# Altium project AudioAmp.PrjPcb
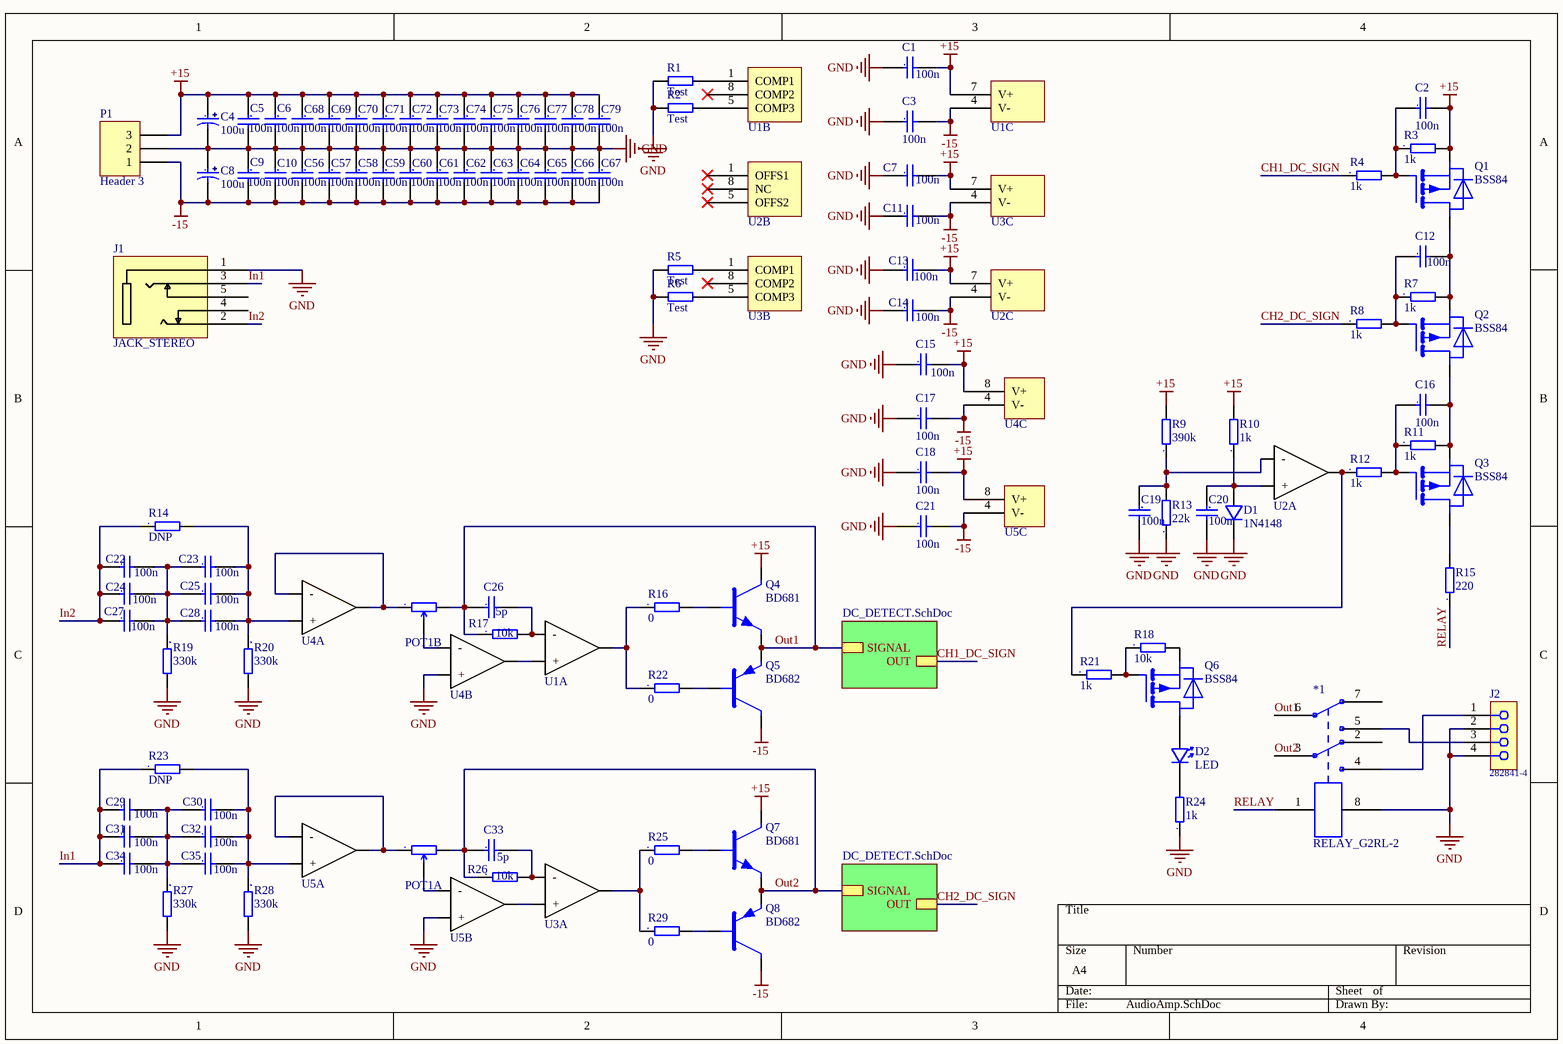
[diagram p0: AudioAmp.SchDoc]
2 sheets, 152 parts. Net scope: hierarchical (ports join the sheet entries above them; power ports are global).
Board file: AudioAmp.PcbDoc
Sheets:
  AudioAmp.SchDoc
    U_DC_DETECT = DC_DETECT.SchDoc
    U_DC_DETECT = DC_DETECT.SchDoc

## Sheet AudioAmp.SchDoc
size A4

### Parts
*1  RELAY_G2RL-2  [G2RL-2]
C1  100n  [C0603_N]
C2  100n  [C0603_N]
C3  100n  [C0603_N]
C4  100u  [C_TR3D]
C5  100n  [C0603_N]
C6  100n  [C0603_N]
C7  100n  [C0603_N]
C8  100u  [C_TR3D]
C9  100n  [C0603_N]
C10  100n  [C0603_N]
C11  100n  [C0603_N]
C12  100n  [C0603_N]
C13  100n  [C0603_N]
C14  100n  [C0603_N]
C15  100n  [C0603_N]
C16  100n  [C0603_N]
C17  100n  [C0603_N]
C18  100n  [C0603_N]
C19  100n  [C0603_N]
C20  100n  [C0603_N]
C21  100n  [C0603_N]
C22  100n  [C0603_N]
C23  100n  [C0603_N]
C24  100n  [C0603_N]
C25  100n  [C0603_N]
C26  5p  [C0603_N]
C27  100n  [C0603_N]
C28  100n  [C0603_N]
C29  100n  [C0603_N]
C30  100n  [C0603_N]
C31  100n  [C0603_N]
C32  100n  [C0603_N]
C33  5p  [C0603_N]
C34  100n  [C0603_N]
C35  100n  [C0603_N]
C56  100n  [C0603_N]
C57  100n  [C0603_N]
C58  100n  [C0603_N]
C59  100n  [C0603_N]
C60  100n  [C0603_N]
C61  100n  [C0603_N]
C62  100n  [C0603_N]
C63  100n  [C0603_N]
C64  100n  [C0603_N]
C65  100n  [C0603_N]
C66  100n  [C0603_N]
C67  100n  [C0603_N]
C68  100n  [C0603_N]
C69  100n  [C0603_N]
C70  100n  [C0603_N]
C71  100n  [C0603_N]
C72  100n  [C0603_N]
C73  100n  [C0603_N]
C74  100n  [C0603_N]
C75  100n  [C0603_N]
C76  100n  [C0603_N]
C77  100n  [C0603_N]
C78  100n  [C0603_N]
C79  100n  [C0603_N]
D1  1N4148  [SOD-80]
D2  LED  [LED_3mm]
J1  JACK_STEREO  [1503 09]
J2  282841-4  [TERM_BLOCK_4x1]
P1  Header 3  [HDR1X3]
POT1  RES_POT_S  [POT_STEREO]  (value not drawn)  (parts A,B of 2)
Q1  BSS84  [SOT23_123_N]
Q2  BSS84  [SOT23_123_N]
Q3  BSS84  [SOT23_123_N]
Q4  BD681  [TO-126]
Q5  BD682  [TO-126]
Q6  BSS84  [SOT23_123_N]
Q7  BD681  [TO-126]
Q8  BD682  [TO-126]
R1  Test  [R0603_N]
R2  Test  [R0603_N]
R3  1k  [R0603_N]
R4  1k  [R0603_N]
R5  Test  [R0603_N]
R6  Test  [R0603_N]
R7  1k  [R0603_N]
R8  1k  [R0603_N]
R9  390k  [R0603_N]
R10  1k  [R0603_N]
R11  1k  [R0603_N]
R12  1k  [R0603_N]
R13  22k  [R0603_N]
R14  DNP  [R0603_N]
R15  220  [R0603_N]
R16  0  [R0603_N]
R17  10k  [R0603_N]
R18  10k  [R0603_N]
R19  330k  [R0603_N]
R20  330k  [R0603_N]
R21  1k  [R0603_N]
R22  0  [R0603_N]
R23  DNP  [R0603_N]
R24  1k  [R0603_N]
R25  0  [R0603_N]
R26  10k  [R0603_N]
R27  330k  [R0603_N]
R28  330k  [R0603_N]
R29  0  [R0603_N]
U1  LM318  [SOIC-8]  (value not drawn)  (parts A,B,C of 3)
U2  uA741  [SOIC-8]  (value not drawn)  (parts A,B,C of 3)
U3  LM318  [SOIC-8]  (value not drawn)  (parts A,B,C of 3)
U4  TL072  [SOIC-8]  (value not drawn)  (parts A,B,C of 3)
U5  TL072  [SOIC-8]  (value not drawn)  (parts A,B,C of 3)

### Sub-sheets
U_DC_DETECT = DC_DETECT.SchDoc: SIGNAL, OUT
U_DC_DETECT = DC_DETECT.SchDoc: SIGNAL, OUT

### Nets
+15: C1.2 C2.2 C4.P C5.1 C6.1 C7.2 C13.2 C15.2 C18.2 C68.1 C69.1 C70.1 C71.1 C72.1 C73.1 C74.1 C75.1 C76.1 C77.1 C78.1 C79.1 P1.3 Q1.S Q4.C Q7.C R3.2 R9.2 R10.2 U1.7(V+) U2.7(V+) U3.7(V+) U4.8(V+) U5.8(V+)
-15: C3.2 C8.N C9.2 C10.2 C11.2 C14.2 C17.2 C21.2 C56.2 C57.2 C58.2 C59.2 C60.2 C61.2 C62.2 C63.2 C64.2 C65.2 C66.2 C67.2 P1.1 Q5.C Q8.C U1.4(V-) U2.4(V-) U3.4(V-) U4.4(V-) U5.4(V-)
GND: *1.8 C1.1 C3.1 C4.N C5.2 C6.2 C7.1 C8.P C9.1 C10.1 C11.1 C13.1 C14.1 C15.1 C17.1 C18.1 C19.2 C20.2 C21.1 C56.1 C57.1 C58.1 C59.1 C60.1 C61.1 C62.1 C63.1 C64.1 C65.1 C66.1 C67.1 C68.2 C69.2 C70.2 C71.2 C72.2 C73.2 C74.2 C75.2 C76.2 C77.2 C78.2 C79.2 D1.C J1.1 J2.2 J2.4 P1.2 R1.2 R2.2 R5.2 R6.2 R13.1 R19.2 R20.2 R24.1 R27.2 R28.2 U4.5(+) U5.5(+)
CH1_DC_SIGN: R4.1 ; sheet U_DC_DETECT/OUT
CH2_DC_SIGN: R8.1 ; sheet U_DC_DETECT/OUT
In1: C29.1 C31.1 C34.1 J1.3 R23.1
In2: C22.1 C24.1 C27.1 J1.2 R14.1
Out1: *1.6 C26.1 POT1.6(CW) Q4.E Q5.E R17.1 ; sheet U_DC_DETECT/SIGNAL
Out2: *1.3 C33.1 POT1.3(CW) Q7.E Q8.E R26.1 ; sheet U_DC_DETECT/SIGNAL
RELAY: *1.1 R15.1
Net*1_4: *1.4 J2.1
Net*1_5: *1.5 J2.3
NetC2_1: C2.1 Q1.G R3.1 R4.2
NetC12_1: C12.1 Q2.G R7.1 R8.2
NetC12_2: C12.2 Q1.D Q2.S R7.2
NetC16_1: C16.1 Q3.G R11.1 R12.2
NetC16_2: C16.2 Q2.D Q3.S R11.2
NetC19_1: C19.1 R9.1 R13.2 U2.2(-)
NetC20_1: C20.1 D1.A R10.1 U2.3(+)
NetC22_2: C22.2 C23.1 C24.2 C25.1 C27.2 C28.1 R19.1
NetC23_2: C23.2 C25.2 C28.2 R14.2 R20.1 U4.3(+)
NetC26_2: C26.2 R17.2 U1.2(-)
NetC29_2: C29.2 C30.1 C31.2 C32.1 C34.2 C35.1 R27.1
NetC30_2: C30.2 C32.2 C35.2 R23.2 R28.1 U5.3(+)
NetC33_2: C33.2 R26.2 U3.2(-)
NetD2_A: D2.A Q6.D
NetD2_K: D2.K R24.2
NetPOT1_1: POT1.1(CCW) U5.1(Out) U5.2(-)
NetPOT1_2: POT1.2(WIPER) U5.6(-)
NetPOT1_4: POT1.4(CCW) U4.1(Out) U4.2(-)
NetPOT1_5: POT1.5(WIPER) U4.6(-)
NetQ3_D: Q3.D R15.2
NetQ4_B: Q4.B R16.2
NetQ5_B: Q5.B R22.2
NetQ6_G: Q6.G R18.1 R21.2
NetQ6_S: Q6.S R18.2
NetQ7_B: Q7.B R25.2
NetQ8_B: Q8.B R29.2
NetR1_1: R1.1 U1.1(COMP1)
NetR2_1: R2.1 U1.5(COMP3)
NetR5_1: R5.1 U3.1(COMP1)
NetR6_1: R6.1 U3.5(COMP3)
NetR12_1: R12.1 R21.1 U2.6(Out)
NetR16_1: R16.1 R22.1 U1.6(Out)
NetR25_1: R25.1 R29.1 U3.6(Out)
NetU1_3: U1.3(+) U4.7(Out)
NetU3_3: U3.3(+) U5.7(Out)

Not connected (* = marked no-connect by the designer): *1 2 7; J1 4 5; U1 8(COMP2)*; U2 1(OFFS1)* 5(OFFS2)* 8(NC)*; U3 8(COMP2)*

### Library data of the parts
C1-C3 C5-C7 C9-C35 C56-C79 = CAP: RevS: $Rev:: 58        $
C4 C8 = CAP_POL: RevS: $Rev:: 58        $
D1 = DIODE
J1 = JACK_STEREO: 3,5mm Stereo Jack connector, Lumberg 1503 09 type
J2 = SOCHDR_4X1: Socket; ComponentLink1Description: Manufacturer; ComponentLink1URL: http://www.we-online.de; ComponentLink2Description: Datasheet; ComponentLink2URL: http://katalog.we-online.de/em/datasheet/691412320002.pdf
P1 = Header 3: Header, 3-Pin; LatestRevisionDate: 17-Jul-2002; LatestRevisionNote: Re-released for DXP Platform.; Publisher: Altium Limited
POT1 = RES_POT_S: Stereo
Q1-Q3 Q6 = MOSFET_P: pin to pad: D>3 G>1 S>2
Q4 Q7 = BJT_NPN
Q5 Q8 = BJT_PNP
R1-R29 = RES
U4 U5 = TL072: Dual op. amp.

## Sheet DC_DETECT.SchDoc
size A4
Used 2 times, as channels U_DC_DETECT, U_DC_DETECT. Parts and nets are listed once, with the designators drawn on the sheet.
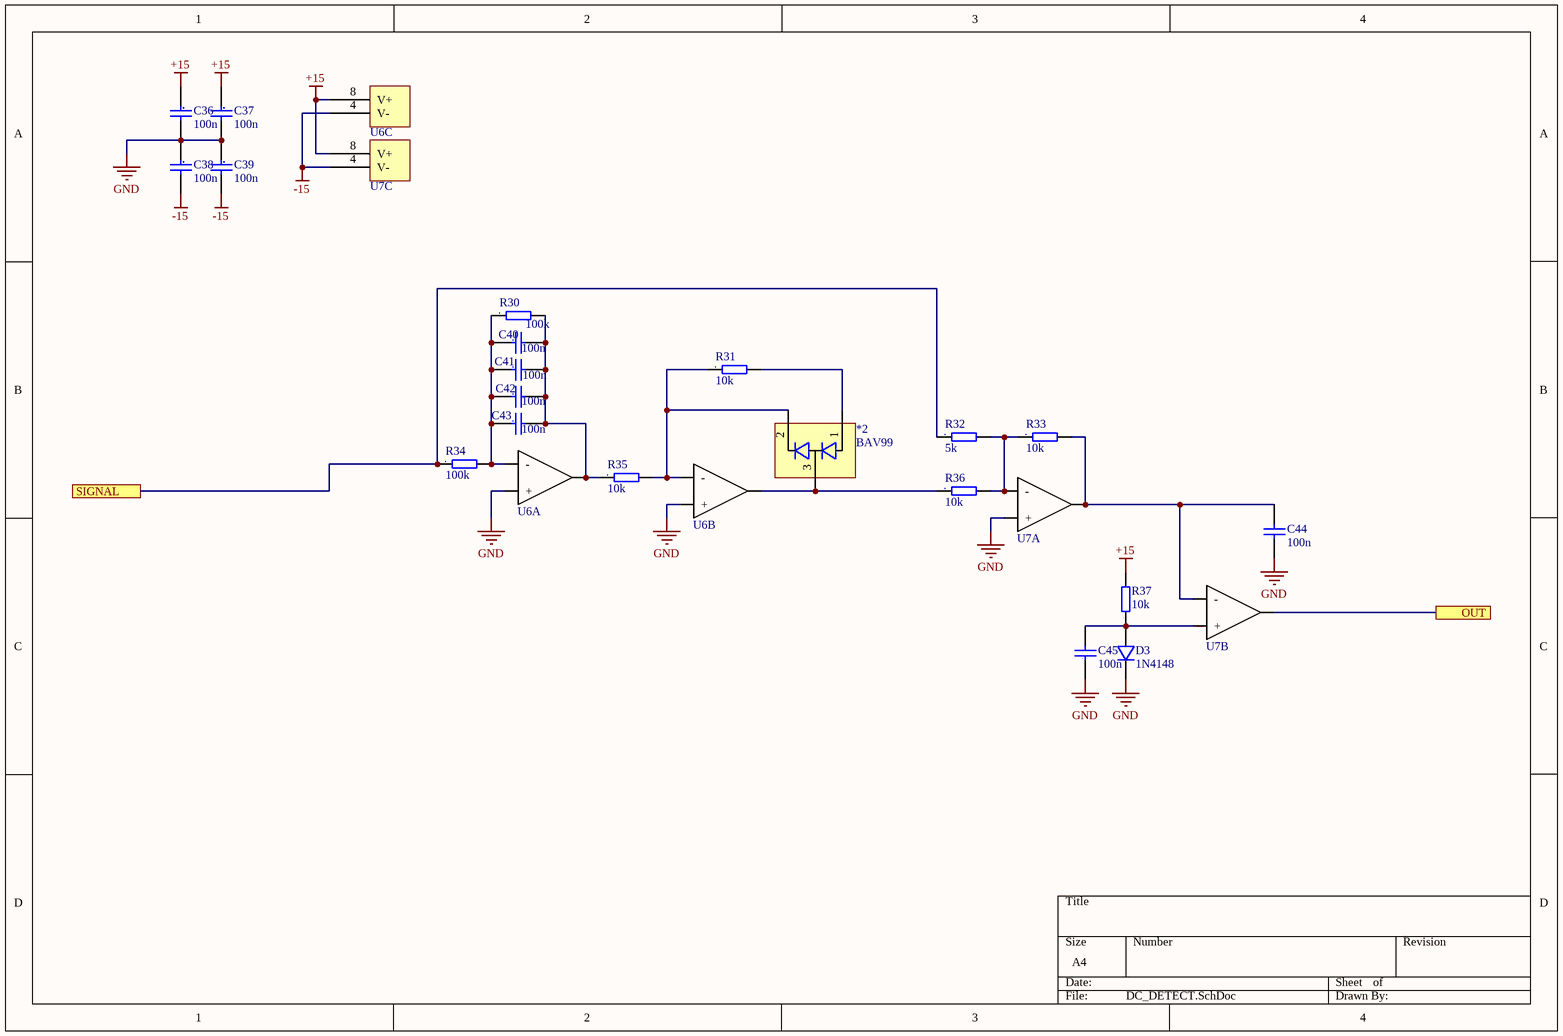
[diagram p1: DC_DETECT.SchDoc]

### Parts
*2  BAV99  [SOT23_123_N]
C36  100n  [C0603_N]
C37  100n  [C0603_N]
C38  100n  [C0603_N]
C39  100n  [C0603_N]
C40  100n  [C0603_N]
C41  100n  [C0603_N]
C42  100n  [C0603_N]
C43  100n  [C0603_N]
C44  100n  [C0603_N]
C45  100n  [C0603_N]
D3  1N4148  [SOD-80]
R30  100k  [R0603_N]
R31  10k  [R0603_N]
R32  5k  [R0603_N]
R33  10k  [R0603_N]
R34  100k  [R0603_N]
R35  10k  [R0603_N]
R36  10k  [R0603_N]
R37  10k  [R0603_N]
U6  LM258  [SOIC-8]  (value not drawn)  (parts A,B,C of 3)
U7  LM258  [SOIC-8]  (value not drawn)  (parts A,B,C of 3)

### Ports
OUT, SIGNAL

### Nets
+15: C36.1 C37.1 R37.2 U6.8(V+) U7.8(V+)
-15: C38.2 C39.2 U6.4(V-) U7.4(V-)
GND: C36.2 C37.2 C38.1 C39.1 C44.1 C45.1 D3.C U6.3(+) U6.5(+) U7.3(+)
OUT: U7.7(Out) ; port OUT
SIGNAL: R32.1 R34.1 ; port SIGNAL
Net*2_1: *2.1(A) R31.2
Net*2_2: *2.2(C) R31.1 R35.2 U6.6(-)
Net*2_3: *2.3(C/A) R36.1 U6.7(Out)
NetC40_1: C40.1 C41.1 C42.1 C43.1 R30.1 R34.2 U6.2(-)
NetC40_2: C40.2 C41.2 C42.2 C43.2 R30.2 R35.1 U6.1(Out)
NetC44_2: C44.2 R33.2 U7.1(Out) U7.6(-)
NetC45_2: C45.2 D3.A R37.1 U7.5(+)
NetR32_2: R32.2 R33.1 R36.2 U7.2(-)

### Channels
U_DC_DETECT: designators *2=*3 C36=C46 C37=C47 C38=C48 C39=C49 C40=C50 C41=C51 C42=C52 C43=C53 C44=C54 C45=C55 D3=D4 R30=R38 R31=R39 R32=R40 R33=R41 R34=R42 R35=R43 R36=R44 R37=R45 U6=U8 U7=U9; ports OUT=CH1_DC_SIGN SIGNAL=Out1
U_DC_DETECT: ports OUT=CH2_DC_SIGN SIGNAL=Out2

### Library data of the parts
C36-C45 = CAP: RevS: $Rev:: 58        $
D3 = DIODE
R30-R37 = RES
U6 U7 = LM258: Dual op. amp., 3..36V, Iq=300uA

## Nets that join several sheets
+15: AudioAmp (33 pins), U_DC_DETECT (5 pins), U_DC_DETECT (5 pins)
-15: AudioAmp (28 pins), U_DC_DETECT (C48.2 C49.2 U8.4 U9.4), U_DC_DETECT (C38.2 C39.2 U6.4 U7.4)
GND: AudioAmp (60 pins), U_DC_DETECT (10 pins), U_DC_DETECT (10 pins)
CH1_DC_SIGN: AudioAmp (R4.1), U_DC_DETECT (U9.7)
CH2_DC_SIGN: AudioAmp (R8.1), U_DC_DETECT (U7.7)
Out1: AudioAmp (6 pins), U_DC_DETECT (R40.1 R42.1)
Out2: AudioAmp (6 pins), U_DC_DETECT (R32.1 R34.1)